# EAGLE design Clamp-header (EAGLE 7.6.0)
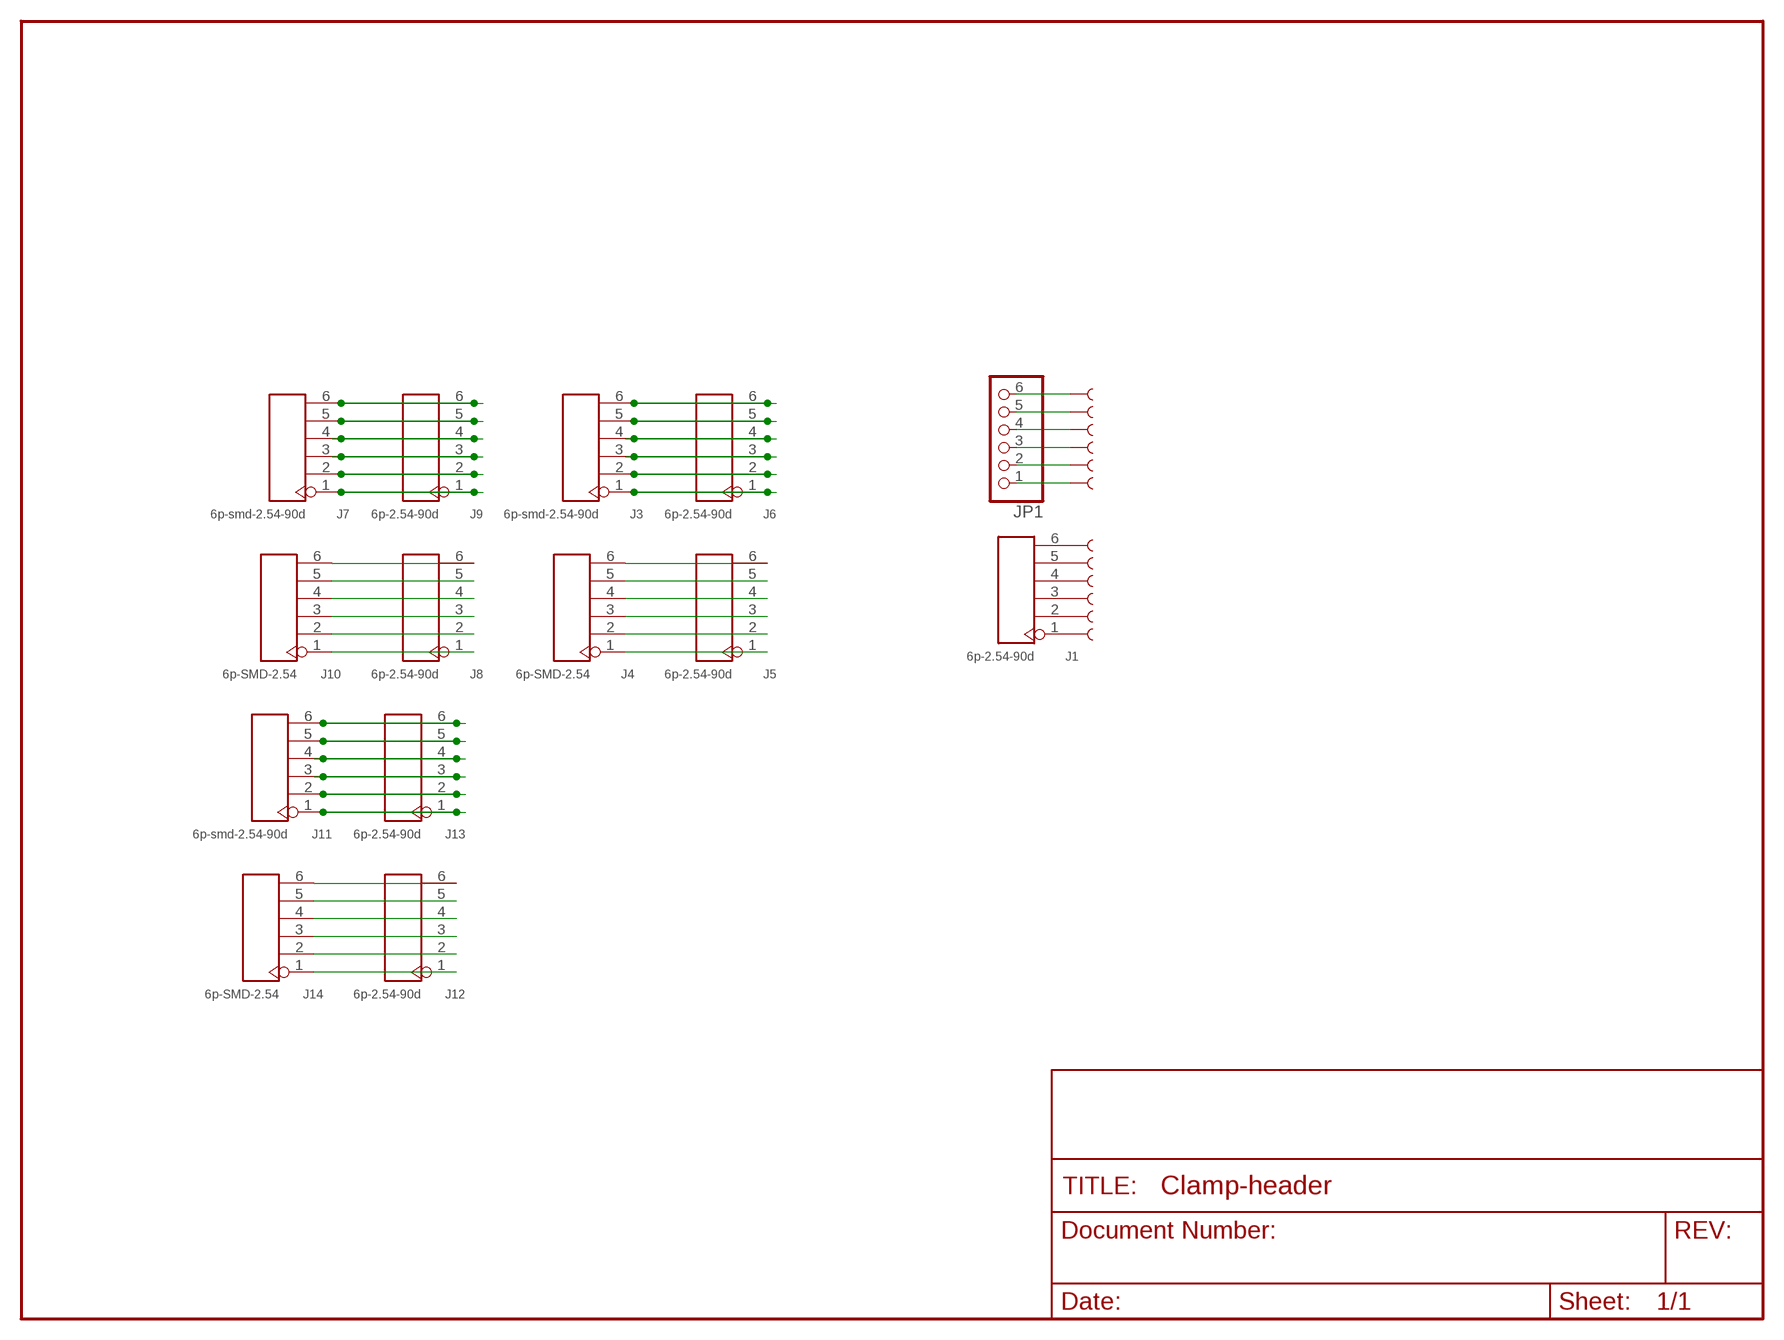
[diagram p0: schematic, sheet 1]

## Parts
J1  6p-2.54-90d  DIP-BLACK-FEMALE-HEADER-R/A(6P-2.54-90D)  [H6-2.54-90D-FEMALE]
J3  6p-smd-2.54-90d  SMD-BLACK-MALE-HEADER(6P-2.54-90D)  [H6-SMD-MALE-2.54-90D]
J4  6p-SMD-2.54  SMD-BLACK-FEMALE-HEADER(6P-2.54)  [H6-SMD-2.54]
J5  6p-2.54-90d  DIP-BLACK-FEMALE-HEADER-R/A(6P-2.54-90D)  [H6-2.54-90D-FEMALE]
J6  6p-2.54-90d  DIP-BLACK-FEMALE-HEADER-R/A(6P-2.54-90D)  [H6-2.54-90D-FEMALE]
J7  6p-smd-2.54-90d  SMD-BLACK-MALE-HEADER(6P-2.54-90D)  [H6-SMD-MALE-2.54-90D]
J8  6p-2.54-90d  DIP-BLACK-FEMALE-HEADER-R/A(6P-2.54-90D)  [H6-2.54-90D-FEMALE]
J9  6p-2.54-90d  DIP-BLACK-FEMALE-HEADER-R/A(6P-2.54-90D)  [H6-2.54-90D-FEMALE]
J10  6p-SMD-2.54  SMD-BLACK-FEMALE-HEADER(6P-2.54)  [H6-SMD-2.54]
J11  6p-smd-2.54-90d  SMD-BLACK-MALE-HEADER(6P-2.54-90D)  [H6-SMD-MALE-2.54-90D]
J12  6p-2.54-90d  DIP-BLACK-FEMALE-HEADER-R/A(6P-2.54-90D)  [H6-2.54-90D-FEMALE]
J13  6p-2.54-90d  DIP-BLACK-FEMALE-HEADER-R/A(6P-2.54-90D)  [H6-2.54-90D-FEMALE]
J14  6p-SMD-2.54  SMD-BLACK-FEMALE-HEADER(6P-2.54)  [H6-SMD-2.54]
JP1  PINHD-1X6/90  [1X06/90]
U$1  SEWTAP1  [SEWTAP]
U$2  SEWTAP1  [SEWTAP]
U$3  SEWTAP1  [SEWTAP]
U$4  SEWTAP1  [SEWTAP]
U$5  SEWTAP1  [SEWTAP]
U$6  SEWTAP1  [SEWTAP]
U$7  SEWTAP1  [SEWTAP]
U$35  SEWTAP1  [SEWTAP]
U$37  SEWTAP1  [SEWTAP]
U$39  SEWTAP1  [SEWTAP]
U$41  SEWTAP1  [SEWTAP]
U$51  SEWTAP1  [SEWTAP]

## Nets
N$1: J1.6 U$51.1
N$2: J1.5 U$41.1
N$3: J1.4 U$35.1
N$4: J1.3 U$37.1
N$5: J1.2 U$39.1
N$6: J1.1 U$4.1
N$7: JP1.6 U$3.1
N$8: JP1.5 U$6.1
N$9: JP1.4 U$7.1
N$10: JP1.3 U$1.1
N$11: JP1.2 U$5.1
N$12: JP1.1 U$2.1
N$13: J3.6 J6.6
N$14: J3.5 J6.5
N$15: J3.4 J6.4
N$16: J3.3 J6.3
N$17: J3.2 J6.2
N$18: J3.1 J6.1
N$19: J4.6 J5.6
N$20: J4.5 J5.5
N$21: J4.4 J5.4
N$22: J4.3 J5.3
N$23: J4.2 J5.2
N$24: J4.1 J5.1
N$25: J7.6 J9.6
N$26: J7.5 J9.5
N$27: J7.4 J9.4
N$28: J7.3 J9.3
N$29: J7.2 J9.2
N$30: J7.1 J9.1
N$31: J8.6 J10.6
N$32: J8.5 J10.5
N$33: J8.4 J10.4
N$34: J8.3 J10.3
N$35: J8.2 J10.2
N$36: J8.1 J10.1
N$37: J11.6 J13.6
N$38: J11.5 J13.5
N$39: J11.4 J13.4
N$40: J11.3 J13.3
N$41: J11.2 J13.2
N$42: J11.1 J13.1
N$43: J12.6 J14.6
N$44: J12.5 J14.5
N$45: J12.4 J14.4
N$46: J12.3 J14.3
N$47: J12.2 J14.2
N$48: J12.1 J14.1

## Library data of the parts
J1 J5 J6 J8 J9 J12 J13 = Seeed-OPL-Connector:DIP-BLACK-FEMALE-HEADER-R/A(6P-2.54-90D): 320030014
J3 J7 J11 = Seeed-OPL-Connector:SMD-BLACK-MALE-HEADER(6P-2.54-90D): 320020143
J4 J10 J14 = Seeed-OPL-Connector:SMD-BLACK-FEMALE-HEADER(6P-2.54): 320030142; MPN: F185-1106A0BZYB1
JP1 = pinhead:PINHD-1X6: PIN HEADER
U$1-U$7 U$35 U$37 U$39 U$41 U$51 = LilyPad-Wearables:SEWTAP

## Net classes
0 Default: width 0.203 mm
1 VCC: width 0.305 mm

## Board
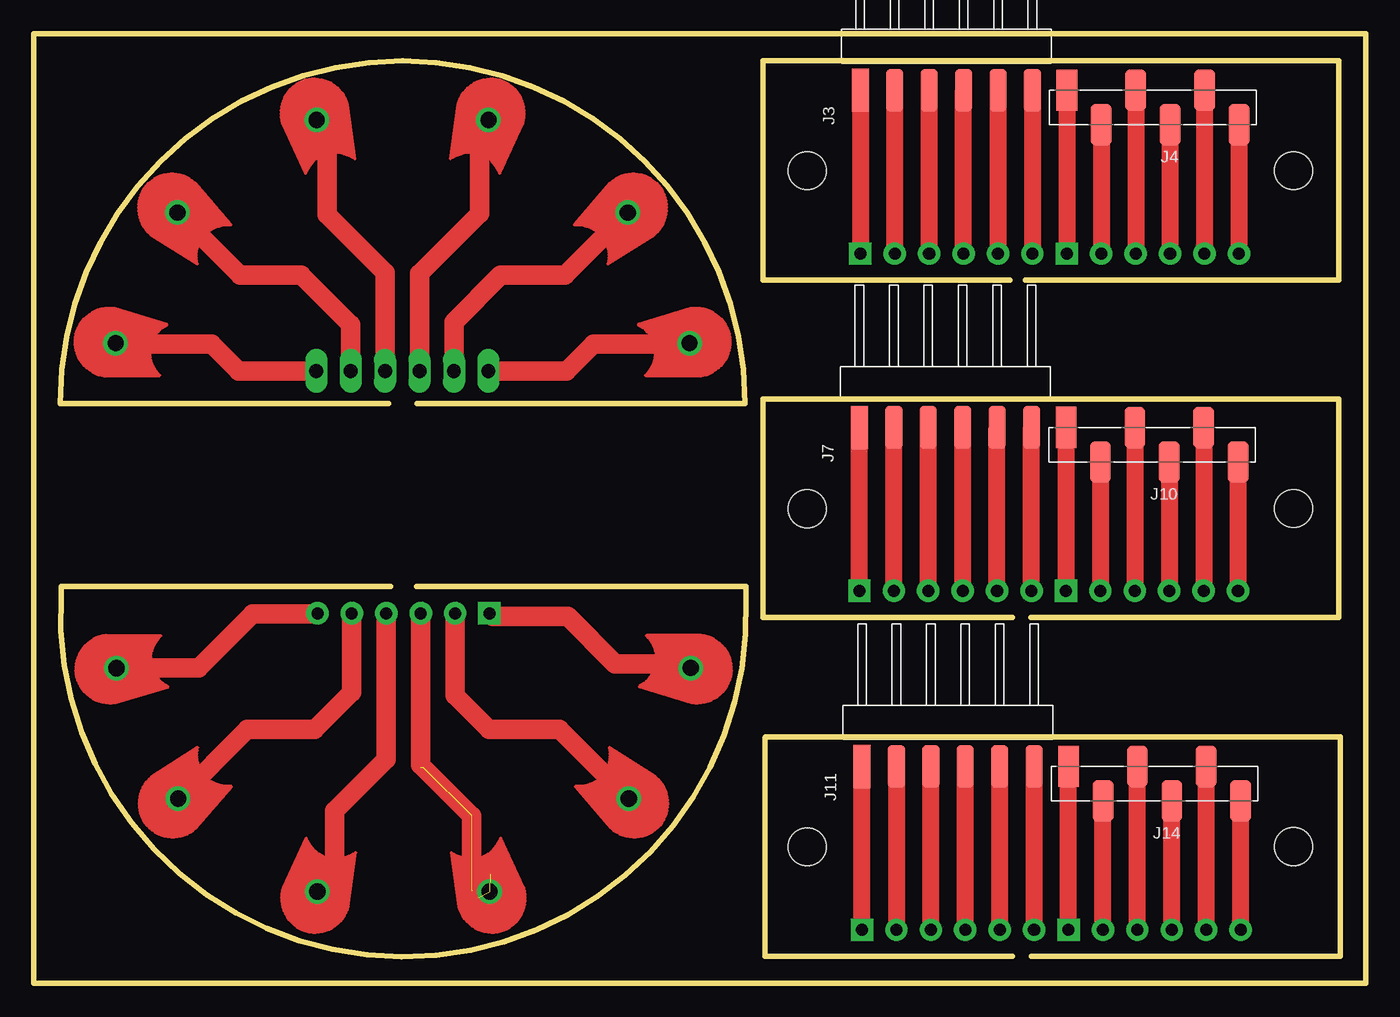
[diagram p1: board, top side]
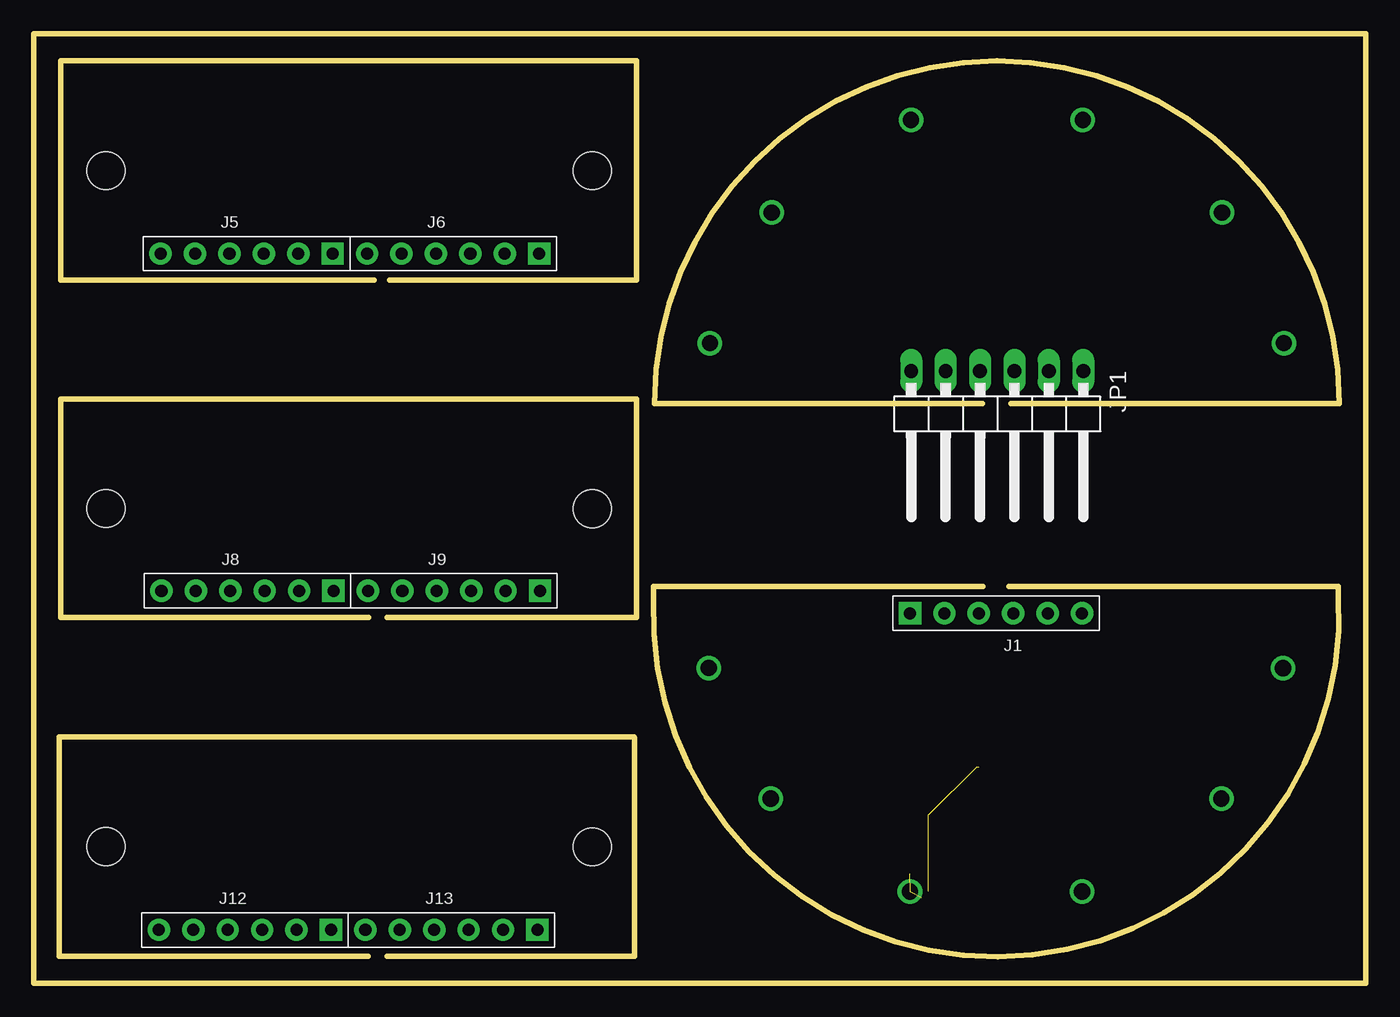
[diagram p2: board, bottom side, seen from below]

Size 98.29 x 70.06 mm. Coordinates in mm from the lower left corner, seen from the top.
Outline: 52.55,28.31 arc-185 2,28.57 2,29.27
Outline: 73.63,1.96 96.43,1.96 96.43,18.15 54.01,18.15
Outline: 96.24,68.06 53.82,68.06 53.82,51.87 72.04,51.87
Outline: 1.94,43.11 1.94,42.85
Outline: 52.55,29.27 52.55,27.74
Outline: 73.19,51.87 96.3,51.87 96.3,68.06
Outline: 72.23,26.98 53.82,26.98 53.82,43.11 96.3,43.11 96.3,26.98 73.57,26.98
Outline: 72.23,1.96 53.95,1.96 53.95,18.09
Outline: 26.2,42.79 1.94,42.79 arc-180 52.49,42.79 28.29,42.79
Outline: 26.32,29.27 2.07,29.27
Outline: 52.49,29.27 28.23,29.27
Outline: 0,0 98.29,0 98.29,70.06 0,70.06 0,0
Copper layers (1*16): Top 0.035mm / dielectric 1.5mm / Bottom 0.035mm
Design rules "SparkFun": minimum track width 8mil, minimum drill 20mil, track to track 8mil, track to pad 8mil, pad to pad 8mil, via to via 8mil, smd to smd 8mil, copper to edge 10mil, drill to drill 8mil, minimum pad ring 12mil, minimum via ring 10mil, stop-mask expansion 4mil, vias tented up to drill 20mil, thermal gap 10mil
Holes 2.8 mm at 57.08,59.97 57.08,35.02 57.08,10.06 92.98,59.96 92.98,35.02 92.98,10.06

### Footprints (pad centres in the part's own frame; a part is rotated, then mirrored left to right if it is on the bottom)
H6-2.54-90D-FEMALE = drill 0.889 pad 1.651 square: 1 0,6.35 | drill 0.889 pad 1.651: 2 0,3.81; 3 0,1.27; 4 0,-1.27; 5 0,-3.81; 6 0,-6.35
H6-SMD-MALE-2.54-90D = smd 3.17 x 1.27: 1 0,6.35; 2 0,3.81; 3 0,1.27; 4 0,-1.27; 5 0,-3.81; 6 0,-6.35
H6-SMD-2.54 = smd 3.048 x 1.524: 1 1.27,6.35; 2 -1.27,3.81; 3 1.27,1.27; 4 -1.27,-1.27; 5 1.27,-3.81; 6 -1.27,-6.35
1X06/90 = drill 1.016 long: 1 -6.35,-3.81; 2 -3.81,-3.81; 3 -1.27,-3.81; 4 1.27,-3.81; 5 3.81,-3.81; 6 6.35,-3.81
SEWTAP = drill 1.2: 1 0.03,0

### Placement (x,y rotation side)
J1  27.28,27.3 90 bottom
J3  67.35,65.91 90 top
J4  82.59,64.64 90 top
J5  82.59,53.84 270 bottom
J6  67.35,53.84 270 bottom
J7  67.28,41.01 90 top
J8  82.52,28.95 270 bottom
J9  67.28,28.95 270 bottom
J10  82.52,39.74 90 top
J11  67.47,15.99 90 top
J12  82.71,3.93 270 bottom
J13  67.47,3.93 270 bottom
J14  82.71,14.72 90 top
JP1  27.19,41.37 180 bottom
U$1  20.86,63.75 286.3 top
U$2  6,47.24 351.8 top
U$3  48.42,47.24 188.2 top
U$4  48.5,23.25 171.8 top
U$5  10.58,56.89 319.1 top
U$6  43.85,56.89 220.9 top
U$7  33.56,63.75 253.7 top
U$35  20.91,6.72 73.7 top
U$37  33.64,6.72 106.3 top
U$39  43.93,13.6 139.1 top
U$41  10.62,13.6 40.9 top
U$51  6.07,23.24 8.2 top

### Tracks (layer width: path | path; a pad name or v marks a point on that pad's centre or on a via)
N$1
  Top 1.422: U$51.1 12.18,23.25 16.16,27.23 20.86,27.23 J1.6
N$2
  Top 1.422: U$41.1 15.74,18.71 20.74,18.71 23.47,21.44 J1.5
N$3
  Top 1.27: 22.07,7.77 U$35.1
  Top 1.422: U$35.1 21.51,7.34 21.82,7.64 22.21,8.03 22.21,12.71 26.01,16.51 J1.4
N$4  (5 unrouted)
  Top 1.422: 32.29,6.79 32.8,6.28 | J1.3 28.55,16.12 32.31,12.36 32.31,8.72 33.43,7.6 33.43,7.86 33.4,7.89 33.4,8.17 33.39,8.18 33.56,8.18 33.66,8.08
N$5
  Top 1.422: U$39.1 38.81,18.71 33.6,18.71 31.09,21.22 J1.2
N$6
  Top 1.422: U$4.1 48.18,23.55 42.9,23.55 39.41,27.04 33.88,27.04 J1.1
N$7
  Top 1.422: JP1.6 39.32,45.18 41.31,47.17 48.33,47.17 U$3.1
N$8
  Top 1.422: JP1.5 31,48.8 34.45,52.25 39.21,52.25 U$6.1
N$9
  Top 1.422: U$7.1 32.88,63.04 32.88,56.8 28.46,52.38 JP1.4
N$10
  Top 1.422: U$1.1 21.65,62.94 21.65,56.72 25.92,52.46 JP1.3
N$11
  Top 1.422: JP1.2 23.38,48.59 19.72,52.25 15.22,52.25 U$5.1
N$12
  Top 1.422: JP1.1 15.11,45.18 13.12,47.17 6.09,47.17 U$2.1
N$13
  Top 1.27: J3.6 J6.6
N$14
  Top 1.27: J3.5 J6.5
N$15
  Top 1.27: J6.4 J3.4
N$16
  Top 1.27: J3.3 J6.3
N$17
  Top 1.27: J6.2 J3.2
N$18
  Top 1.27: J3.1 J6.1
N$19
  Top 1.27: J4.6 J5.6
N$20
  Top 1.27: J4.5 J5.5
N$21
  Top 1.27: J4.4 J5.4
N$22
  Top 1.27: J4.3 J5.3
N$23
  Top 1.27: J4.2 J5.2
N$24
  Top 1.27: J4.1 J5.1
N$25
  Top 1.27: J9.6 J7.6
N$26
  Top 1.27: J9.5 J7.5
N$27
  Top 1.27: J9.4 J7.4
N$28
  Top 1.27: J9.3 J7.3
N$29
  Top 1.27: J9.2 J7.2
N$30
  Top 1.27: J9.1 J7.1
N$31
  Top 1.27: J10.6 J8.6
N$32
  Top 1.27: J10.5 J8.5
N$33
  Top 1.27: J10.4 J8.4
N$34
  Top 1.27: J10.3 J8.3
N$35
  Top 1.27: J10.2 J8.2
N$36
  Top 1.27: J10.1 J8.1
N$37
  Top 1.27: J13.6 J11.6
N$38
  Top 1.27: J13.5 J11.5
N$39
  Top 1.27: J13.4 J11.4
N$40
  Top 1.27: J13.3 J11.3
N$41
  Top 1.27: J11.2 J13.2
N$42
  Top 1.27: J13.1 J11.1
N$43
  Top 1.27: J12.6 J14.6
N$44
  Top 1.27: J12.5 J14.5
N$45
  Top 1.27: J12.4 J14.4
N$46
  Top 1.27: J12.3 J14.3
N$47
  Top 1.27: J12.2 J14.2
N$48
  Top 1.27: J12.1 J14.1